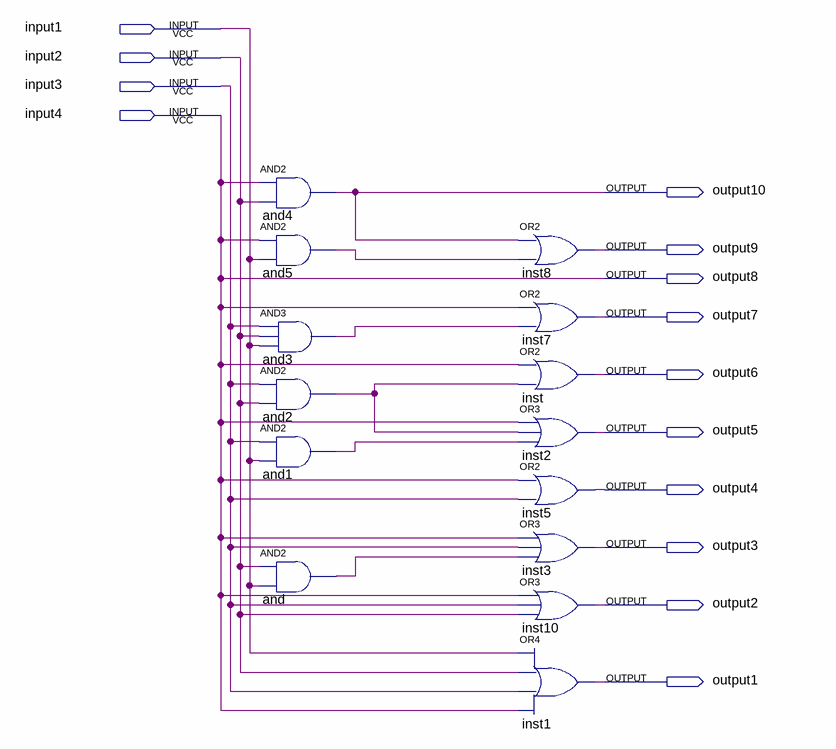
[diagram p0: schematic sheet]
// Quartus schematic guage.bdf as structural Verilog: 14 symbols, 14 pins
module guage (
  input  input1,
  input  input2,
  input  input3,
  input  input4,
  output output10,
  output output9,
  output output8,
  output output7,
  output output6,
  output output5,
  output output4,
  output output3,
  output output2,
  output output1
);

  wire and1_out, and2_out, and3_out, and5_out, and_out;

  and and4 (output10, input4, input2);
  and and5 (and5_out, input4, input1);
  and and3 (and3_out, input3, input2, input1);
  and and2 (and2_out, input3, input2);
  and and1 (and1_out, input3, input1);
  and \and  (and_out, input2, input1);
  or inst8 (output9, output10, and5_out);
  or inst7 (output7, input4, and3_out);
  or inst (output6, input4, and2_out);
  or inst2 (output5, input4, and2_out, and1_out);
  or inst5 (output4, input4, input3);
  or inst3 (output3, input4, input3, and_out);
  or inst10 (output2, input4, input3, input2);
  or inst1 (output1, input1, input2, input3, input4);

  assign output8 = input4;
endmodule
